# Altium schematic sheet JTAG.SchDoc: {Наименование}
size 420 x 297 mm; DocumentNumber: ПЛАС.ХХХХХХ.ХХХ ХХ; SheetNumber: 5; SheetTotal: 11; PageSetup: Record=PageOptions|CenterHorizontal=False|CenterVertical=False|PrintScale=0.95|XCorrection=0.00|YCorrection=0.00|PrintKind=1|BorderSize=5000000|LeftOffset=0|BottomOffset=0|Orientation=1|PaperLength=1000|PaperWidth=1000|Scale=100|PaperSource=15|PrintQuality=600|MediaType=1|DitherType=10|PaperKind=A4|PrintScaleMode=1; Rule: PcbType=ProtelPcb
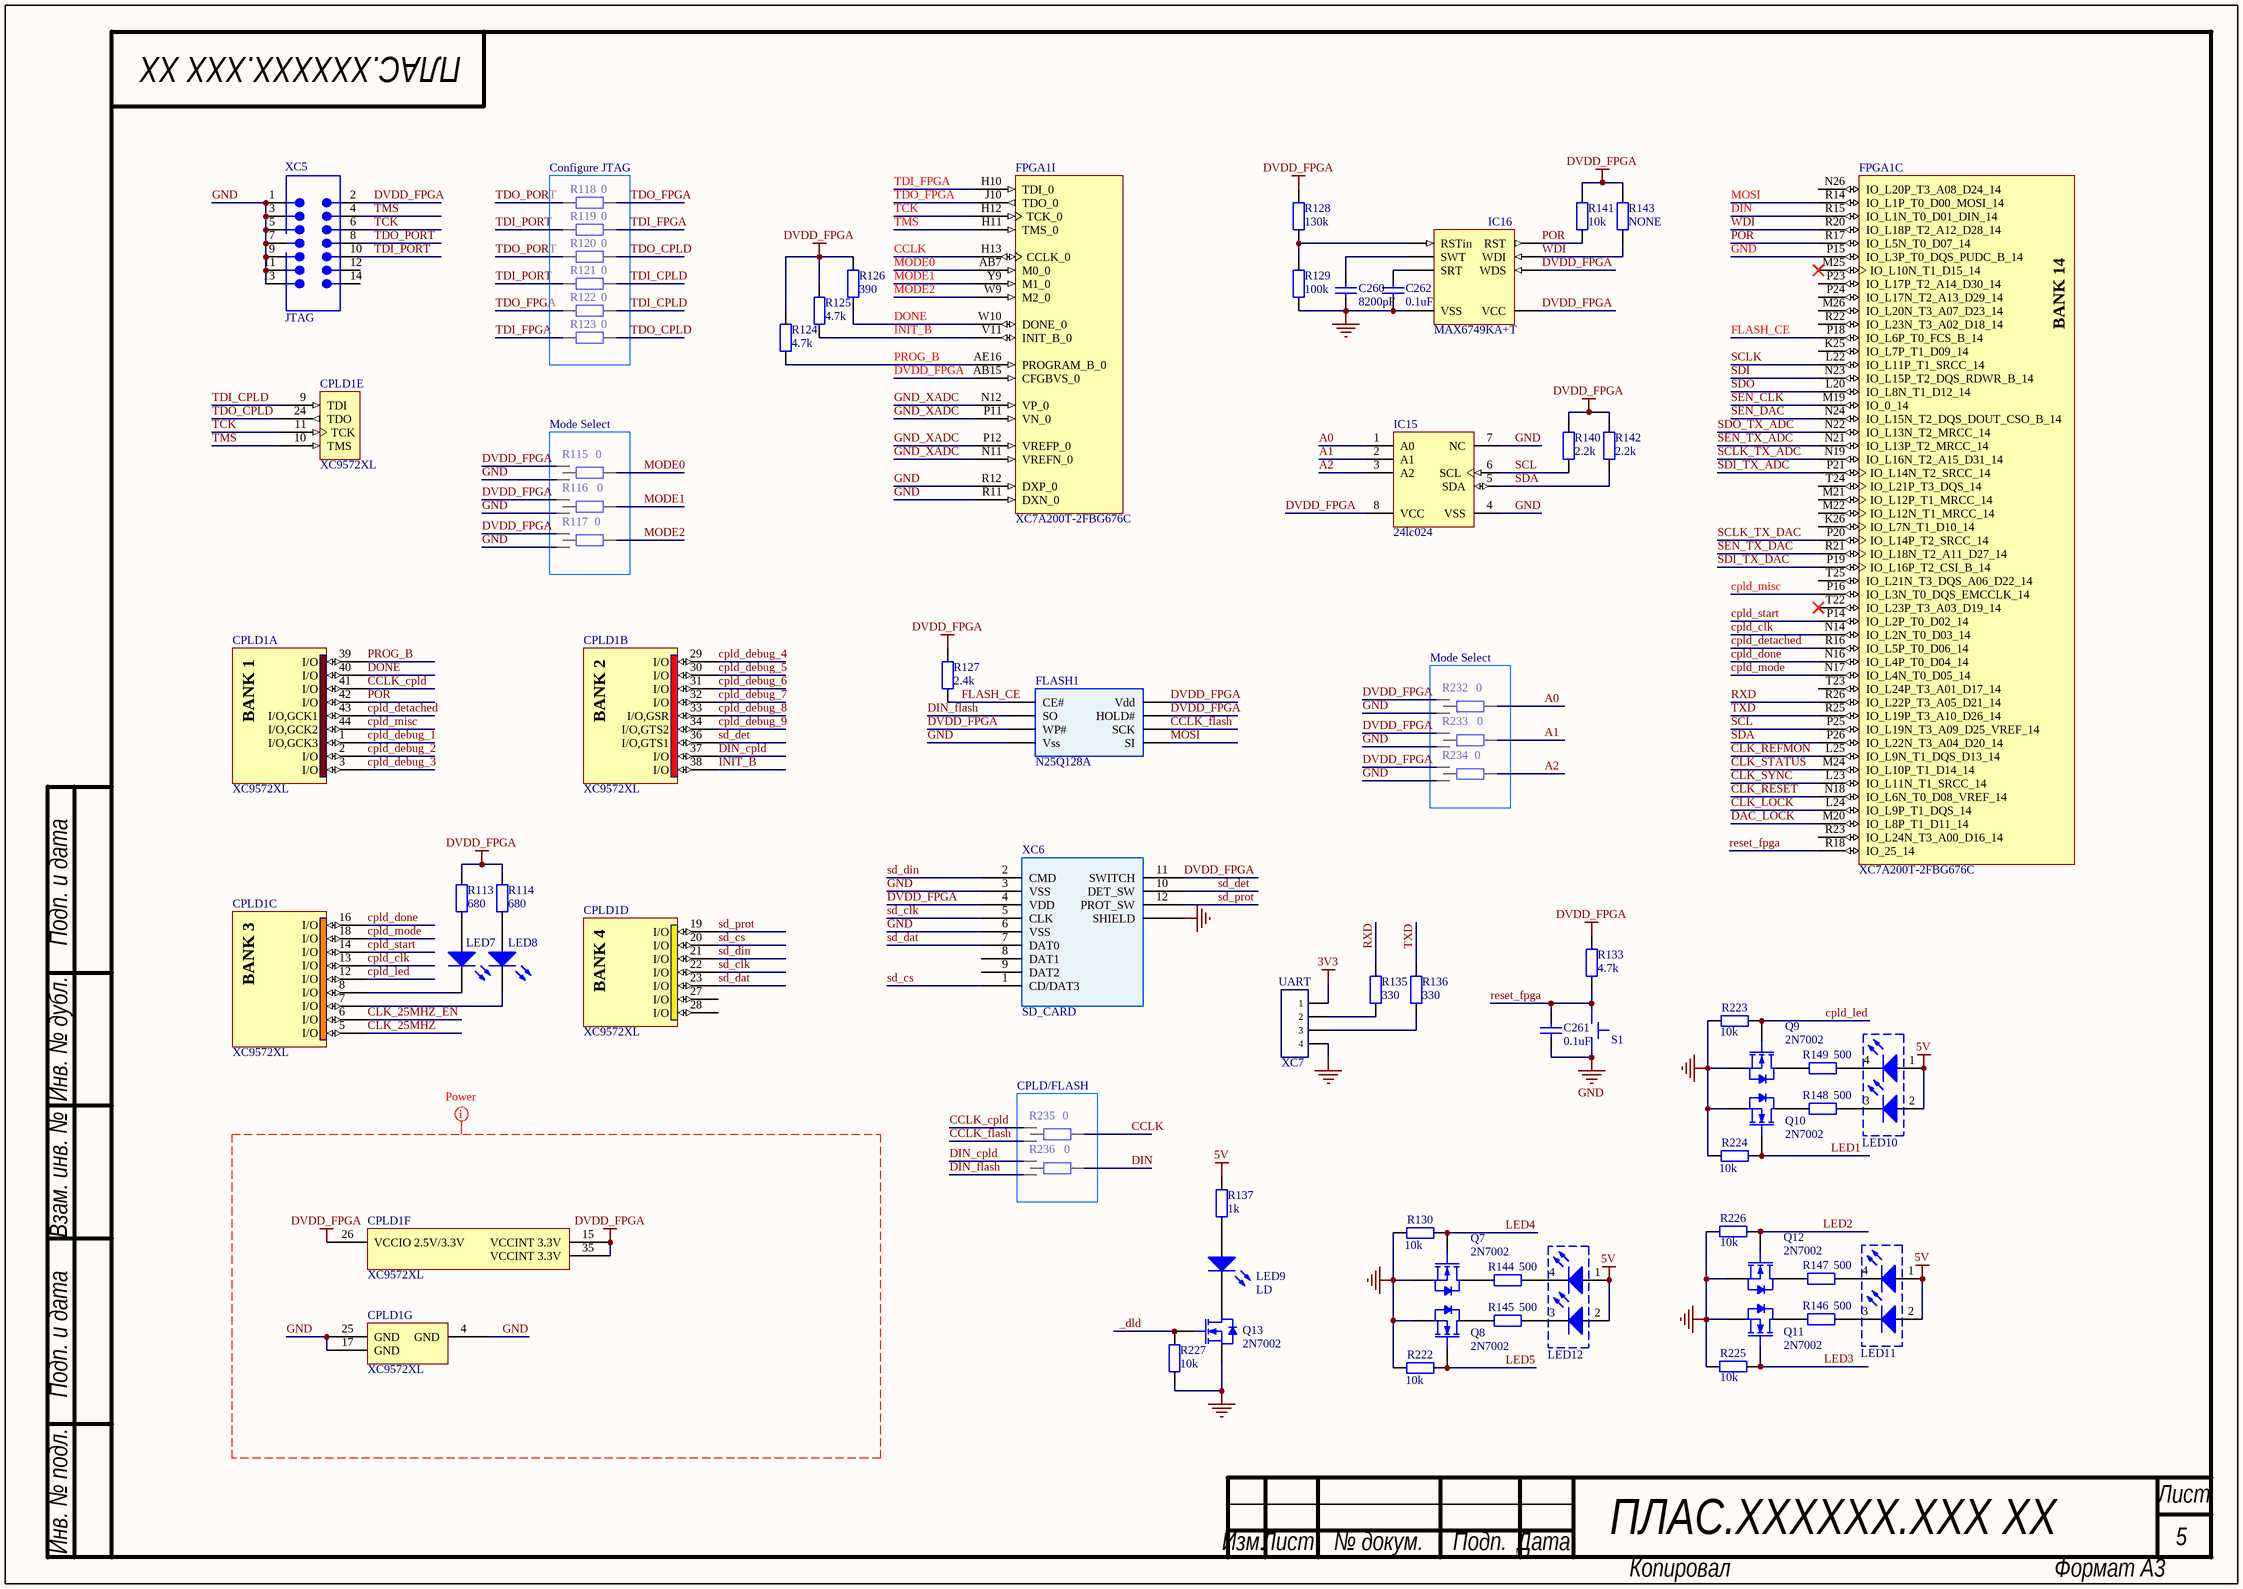
[diagram p0: JTAG.SchDoc]

## Parts
C260  value 8200pF  [C0603]  (hidden comment: Cap)
C261  value 0.1uF  [C0603]  (hidden comment: Cap)
C262  value 0.1uF  [C0603]  (hidden comment: Cap)
CPLD1  XC9572XL  [VQFP44]  (parts A,B,C,D,E,F,G of 7)
FLASH1  N25Q128A  [SOIC8-W]
FPGA1  XC7A200T-2FBG676C  [FGG676]  (parts C,I of 14)
IC15  24lc024  [SOIC_SN8]
IC16  MAX6749KA+T  [SOT-23-8]
LED7  LED  [LED_0402_Blue]  (value not drawn)
LED8  LED  [LED_0402_Blue]  (value not drawn)
LED9  LD  [LED_0402_Blue]
LED10  Green  [LED_PACK]  (value not drawn)
LED11  Green  [LED_PACK]  (value not drawn)
LED12  Green  [LED_PACK]  (value not drawn)
Q7  2N7002  [SOT-23]
Q8  2N7002  [SOT-23]
Q9  2N7002  [SOT-23]
Q10  2N7002  [SOT-23]
Q11  2N7002  [SOT-23]
Q12  2N7002  [SOT-23]
Q13  2N7002  [SOT-23]
R113  value 680  [R0402]  (hidden comment: Res)
R114  value 680  [R0402]  (hidden comment: Res)
R115  value 0  [R0402_Switch]  (hidden comment: Res_Switch)
R116  value 0  [R0402_Switch]  (hidden comment: Res_Switch)
R117  value 0  [R0402_Switch]  (hidden comment: Res_Switch)
R118  value 0  [R0402]  (hidden comment: Res)
R119  value 0  [R0402]  (hidden comment: Res)
R120  value 0  [R0402]  (hidden comment: Res)
R121  value 0  [R0402]  (hidden comment: Res)
R122  value 0  [R0402]  (hidden comment: Res)
R123  value 0  [R0402]  (hidden comment: Res)
R124  value 4.7k  [R0402]  (hidden comment: Res)
R125  value 4.7k  [R0402]  (hidden comment: Res)
R126  value 390  [R0402]  (hidden comment: Res)
R127  value 2.4k  [R0402]  (hidden comment: Res)
R128  value 130k  [R0402]  (hidden comment: Res)
R129  value 100k  [R0402]  (hidden comment: Res)
R130  value 10k  [R0402]  (hidden comment: Res)
R133  value 4.7k  [R0402]  (hidden comment: Res)
R135  value 330  [R0402]  (hidden comment: Res)
R136  value 330  [R0402]  (hidden comment: Res)
R137  value 1k  [R0402]  (hidden comment: Res)
R140  value 2.2k  [R0402]  (hidden comment: Res)
R141  value 10k  [R0402]  (hidden comment: Res)
R142  value 2.2k  [R0402]  (hidden comment: Res)
R143  value NONE  [R0402]  (hidden comment: Res)
R144  value 500  [R0402]  (hidden comment: Res)
R145  value 500  [R0402]  (hidden comment: Res)
R146  value 500  [R0402]  (hidden comment: Res)
R147  value 500  [R0402]  (hidden comment: Res)
R148  value 500  [R0402]  (hidden comment: Res)
R149  value 500  [R0402]  (hidden comment: Res)
R222  value 10k  [R0402]  (hidden comment: Res)
R223  value 10k  [R0402]  (hidden comment: Res)
R224  value 10k  [R0402]  (hidden comment: Res)
R225  value 10k  [R0402]  (hidden comment: Res)
R226  value 10k  [R0402]  (hidden comment: Res)
R227  value 10k  [R0402]  (hidden comment: Res)
R232  value 0  [R0402_Switch]  (hidden comment: Res_Switch)
R233  value 0  [R0402_Switch]  (hidden comment: Res_Switch)
R234  value 0  [R0402_Switch]  (hidden comment: Res_Switch)
R235  value 0  [R0402_Switch]  (hidden comment: Res_Switch)
R236  value 0  [R0402_Switch]  (hidden comment: Res_Switch)
S1  RST_FPGA  [B3FS-1000]  (value not drawn)
XC5  JTAG  [JTAG Mail]
XC6  SD_CARD  [SD_Card]
XC7  UART  [Right Angle Male Header]

## Blocks framed on the sheet
Configure JTAG: R118-R123
Mode Select: R115-R117
Mode Select: R232-R234
CPLD/FLASH: R235 R236

## Nets
3V3: XC7.1
5V: LED10.1(A) LED10.2(A) LED11.1(A) LED11.2(A) LED12.1(A) LED12.2(A) R137.2
DVDD_FPGA: CPLD1.15(VCCINT_3.3V) CPLD1.26(VCCIO_2.5V/3.3V) CPLD1.35(VCCINT_3.3V) FLASH1.3(WP#) FLASH1.7(HOLD#) FLASH1.8(Vdd) FPGA1.AB15(CFGBVS_0) IC15.8(VCC) IC16.5(WDS) IC16.8(VCC) R113.2 R114.2 R115.1 R116.1 R117.1 R124.1 R125.2 R126.1 R127.1 R128.2 R133.2 R140.2 R141.2 R142.2 R143.2 R232.1 R233.1 R234.1 XC5.2(VREF) XC6.4(VDD) XC6.11(SWITCH)
GND: C260.1 C261.2 C262.1 CPLD1.4(GND) CPLD1.17(GND) CPLD1.25(GND) FLASH1.4(Vss) FPGA1.P15(IO_L3P_T0_DQS_PUDC_B_14) FPGA1.R11(DXN_0) FPGA1.R12(DXP_0) IC15.4(VSS) IC15.7(NC) IC16.4(VSS) Q7.2(S) Q8.2(S) Q9.2(S) Q10.2(S) Q11.2(S) Q12.2(S) Q13.2(S) R115.3 R116.3 R117.3 R129.1 R130.2 R222.2 R223.2 R224.2 R225.2 R226.2 R227.1 R232.3 R233.3 R234.3 S1.2 XC5.1(GND) XC5.3(GND) XC5.5(GND) XC5.7(GND) XC5.9(GND) XC5.11(GND) XC5.13(GND) XC6.0(SHIELD) XC6.3(VSS) XC6.6(VSS) XC7.4
_dld: Q13.1(G) R227.2
A0: IC15.1(A0) R232.2
A1: IC15.2(A1) R233.2
A2: IC15.3(A2) R234.2
CCLK: FPGA1.H13(CCLK_0) R235.2
CCLK_cpld: CPLD1.41(I/O) R235.1
CCLK_flash: FLASH1.6(SCK) R235.3
CLK_25MHZ: CPLD1.5(I/O)
CLK_25MHZ_EN: CPLD1.6(I/O)
CLK_LOCK: FPGA1.L24(IO_L9P_T1_DQS_14)
CLK_REFMON: FPGA1.L25(IO_L9N_T1_DQS_D13_14)
CLK_RESET: FPGA1.N18(IO_L6N_T0_D08_VREF_14)
CLK_STATUS: FPGA1.M24(IO_L10P_T1_D14_14)
CLK_SYNC: FPGA1.L23(IO_L11N_T1_SRCC_14)
cpld_clk: CPLD1.13(I/O) FPGA1.N14(IO_L2N_T0_D03_14)
cpld_debug_1: CPLD1.1(I/O,GCK3)
cpld_debug_2: CPLD1.2(I/O)
cpld_debug_3: CPLD1.3(I/O)
cpld_debug_4: CPLD1.29(I/O)
cpld_debug_5: CPLD1.30(I/O)
cpld_debug_6: CPLD1.31(I/O)
cpld_debug_7: CPLD1.32(I/O)
cpld_debug_8: CPLD1.33(I/O,GSR)
cpld_debug_9: CPLD1.34(I/O,GTS2)
cpld_detached: CPLD1.43(I/O,GCK1) FPGA1.R16(IO_L5P_T0_D06_14)
cpld_done: CPLD1.16(I/O) FPGA1.N16(IO_L4P_T0_D04_14)
cpld_led: CPLD1.12(I/O) Q9.1(G) R223.1
cpld_misc: CPLD1.44(I/O,GCK2) FPGA1.P16(IO_L3N_T0_DQS_EMCCLK_14)
cpld_mode: CPLD1.18(I/O) FPGA1.N17(IO_L4N_T0_D05_14)
cpld_start: CPLD1.14(I/O) FPGA1.P14(IO_L2P_T0_D02_14)
DAC_LOCK: FPGA1.M20(IO_L8P_T1_D11_14)
DIN: FPGA1.R15(IO_L1N_T0_D01_DIN_14) R236.2
DIN_cpld: CPLD1.37(I/O) R236.1
DIN_flash: FLASH1.2(SO) R236.3
DONE: CPLD1.40(I/O) FPGA1.W10(DONE_0) R126.2
FLASH_CE: FLASH1.1(CE#) FPGA1.P18(IO_L6P_T0_FCS_B_14) R127.2
GND_XADC: FPGA1.N11(VREFN_0) FPGA1.N12(VP_0) FPGA1.P11(VN_0) FPGA1.P12(VREFP_0)
INIT_B: CPLD1.38(I/O) FPGA1.V11(INIT_B_0) R125.1
LED1: Q10.1(G) R224.1
LED2: Q12.1(G) R226.1
LED3: Q11.1(G) R225.1
LED4: Q7.1(G) R130.1
LED5: Q8.1(G) R222.1
MODE0: FPGA1.AB7(M0_0) R115.2
MODE1: FPGA1.Y9(M1_0) R116.2
MODE2: FPGA1.W9(M2_0) R117.2
MOSI: FLASH1.5(SI) FPGA1.R14(IO_L1P_T0_D00_MOSI_14)
POR: CPLD1.42(I/O) FPGA1.R17(IO_L5N_T0_D07_14) IC16.7(RST) R141.1
PROG_B: CPLD1.39(I/O) FPGA1.AE16(PROGRAM_B_0) R124.2
reset_fpga: C261.1 FPGA1.R18(IO_25_14) R133.1 S1.1
RXD: FPGA1.R26(IO_L22P_T3_A05_D21_14) R135.1
SCL: FPGA1.P25(IO_L19N_T3_A09_D25_VREF_14) IC15.6(SCL) R140.1
SCLK: FPGA1.L22(IO_L11P_T1_SRCC_14)
SCLK_TX_ADC: FPGA1.N19(IO_L16N_T2_A15_D31_14)
SCLK_TX_DAC: FPGA1.P20(IO_L14P_T2_SRCC_14)
sd_clk: CPLD1.22(I/O) XC6.5(CLK)
sd_cs: CPLD1.20(I/O) XC6.1(CD/DAT3)
sd_dat: CPLD1.23(I/O) XC6.7(DAT0)
sd_det: CPLD1.36(I/O,GTS1) XC6.10(DET_SW)
sd_din: CPLD1.21(I/O) XC6.2(CMD)
sd_prot: CPLD1.19(I/O) XC6.12(PROT_SW)
SDA: FPGA1.P26(IO_L22N_T3_A04_D20_14) IC15.5(SDA) R142.1
SDI: FPGA1.N23(IO_L15P_T2_DQS_RDWR_B_14)
SDI_TX_ADC: FPGA1.P21(IO_L14N_T2_SRCC_14)
SDI_TX_DAC: FPGA1.P19(IO_L16P_T2_CSI_B_14)
SDO: FPGA1.L20(IO_L8N_T1_D12_14)
SDO_TX_ADC: FPGA1.N22(IO_L13N_T2_MRCC_14)
SEN_CLK: FPGA1.M19(IO_0_14)
SEN_DAC: FPGA1.N24(IO_L15N_T2_DQS_DOUT_CSO_B_14)
SEN_TX_ADC: FPGA1.N21(IO_L13P_T2_MRCC_14)
SEN_TX_DAC: FPGA1.R21(IO_L18N_T2_A11_D27_14)
TCK: CPLD1.11(TCK) FPGA1.H12(TCK_0) XC5.6(TCK)
TDI_CPLD: CPLD1.9(TDI) R121.2 R122.2
TDI_FPGA: FPGA1.H10(TDI_0) R119.2 R123.1
TDI_PORT: R119.1 R121.1 XC5.10(TDI)
TDO_CPLD: CPLD1.24(TDO) R120.2 R123.2
TDO_FPGA: FPGA1.J10(TDO_0) R118.2 R122.1
TDO_PORT: R118.1 R120.1 XC5.8(TDO)
TMS: CPLD1.10(TMS) FPGA1.H11(TMS_0) XC5.4(TMS)
TXD: FPGA1.R25(IO_L19P_T3_A10_D26_14) R136.1
WDI: FPGA1.R20(IO_L18P_T2_A12_D28_14) IC16.6(WDI) R143.1
NetC260_2: C260.2 IC16.2(SWT)
NetC262_2: C262.2 IC16.3(SRT)
NetCPLD1_7: CPLD1.7(I/O) LED8.1(K)
NetCPLD1_8: CPLD1.8(I/O) LED7.1(K)
NetIC16_1: IC16.1(RSTin) R128.1 R129.2
NetLED7_2: LED7.2(A) R113.1
NetLED8_2: LED8.2(A) R114.1
NetLED9_1: LED9.1(K) Q13.3(D)
NetLED9_2: LED9.2(A) R137.1
NetLED10_3: LED10.3(K) R148.2
NetLED10_4: LED10.4(K) R149.1
NetLED11_3: LED11.3(K) R146.2
NetLED11_4: LED11.4(K) R147.2
NetLED12_3: LED12.3(K) R145.1
NetLED12_4: LED12.4(K) R144.1
NetQ7_3: Q7.3(D) R144.2
NetQ8_3: Q8.3(D) R145.2
NetQ9_3: Q9.3(D) R149.2
NetQ10_3: Q10.3(D) R148.1
NetQ11_3: Q11.3(D) R146.1
NetQ12_3: Q12.3(D) R147.1
NetR135_2: R135.2 XC7.2
NetR136_2: R136.2 XC7.3

Not connected (* = marked no-connect by the designer): CPLD1 27(I/O) 28(I/O); FPGA1 K25(IO_L7P_T1_D09_14) K26(IO_L7N_T1_D10_14) M21(IO_L12P_T1_MRCC_14) M22(IO_L12N_T1_MRCC_14) M25(IO_L10N_T1_D15_14)* M26(IO_L20N_T3_A07_D23_14) N26(IO_L20P_T3_A08_D24_14) P23(IO_L17P_T2_A14_D30_14) P24(IO_L17N_T2_A13_D29_14) R22(IO_L23N_T3_A02_D18_14) R23(IO_L24N_T3_A00_D16_14) T22(IO_L23P_T3_A03_D19_14)* T23(IO_L24P_T3_A01_D17_14) T24(IO_L21P_T3_DQS_14) T25(IO_L21N_T3_DQS_A06_D22_14); XC5 12(NC) 14(SRST); XC6 8(DAT1) 9(DAT2)

## Layout directives
net class Power: DVDD_FPGA, GND

## Notes on the sheet
- Подп. и дата
- Инв. № дубл.
- Взам. инв. №
- Инв. № подл.
- Лист
- Изм.
- № докум.
- Подп.
- Дата
- Копировал
- Формат А3
- (in symbol XC7A200T-2FBG676C, part C) BANK 14
- (in symbol XC9572XL-10VQ44C, part A) BANK 1
- (in symbol XC9572XL-10VQ44C, part B) BANK 2
- (in symbol XC9572XL-10VQ44C, part C) BANK 3
- (in symbol XC9572XL-10VQ44C, part D) BANK 4

## Library data of the parts
C260 = Cer Cap: Cer Cap Small; Manufacturer: Murata; Material: x7r; Voltage: 50V; Tolerance: 10%; Type: Ceramic; PackageReference: SMD Chip Capacitor; Package: 0603
C261 C262 = Cer Cap: Cer Cap Small; Manufacturer: Murata; Material: x7r; Voltage: 16V; Tolerance: 10%; Type: Ceramic; PackageReference: SMD Chip Capacitor; Package: 0603
CPLD1 = XC9572XL-10VQ44C: FastFLASH XC900XL, 3.3V High-Performance 72 Macrocell CPLD, 34 User I/Os, 44-Pin VQFP, Speed Grade 10, Commercial Grade; Supply Current: 20 mA; Max Operational Frequency: 100 MHz; Gates: 1600; Macrocells: 72; User I/O: 34; Name: XC9572XL-10VQ44C; Voltage: 3.3 V; Package: VQFP44; Type: CPLD
FLASH1 = SST25VF016B-xx-xx-S2Ax: SPI Flash; Manufacturer: Micron Technology; Name: N25Q128A13ESE40F; Operating Frequency: 50 MHz; Device Density: 128 Mbit; Voltage: 2.7-3.6V; Type: SPI Flash; Package: SOIC; Temperature Range: 0°C to +70°C
FPGA1 = XC7A200T-2FBG676C: Artix-7 FPGA, 400 User I/Os, 8 GTP, 676-Ball BGA, Speed Grade 2, Commercial Grade, Pb-Free; Manufacturer: Xilinx; Block RAM Blocks (18Kb): 730; Block RAM Blocks (36Kb): 365; Block RAM Blocks (Max Kb): 13140; CLBs (Slices): 33650; Clock Mgmt Tiles (CMTs): 10; DSP48E1 Slices: 740; Logic Cells: 215360; Max User I/O: 500; Speed Grade: -2; DatasheetVersion: v1.12; PackageVersion: Rev 1.8; PackageReference: FBG676; PackageDescription: Flip-Chip Lidless BGA, Body 27 x 27 mm, 1.0 mm Pitch; Supplier 1: Digi-Key; Supplier Part Number 1: 122-1865-ND; CLBs (Max Distributed RAM Kb): 2888; Generic Part Number: XC7A200T; RoHS: Pb-Free; NexusDeviceID: XC7A200T-2FBG676C; Mounting Technology: Surface Mount; Code_JEDEC: MS-034; PartNumber: XC7A200T-2FBG676C; ComponentLink1Description: Manufacturer URL; ComponentLink1URL: http://www.xilinx.com/; ComponentLink2Description: Datasheet; ComponentLink2URL: http://www.xilinx.com/support/documentation/data_sheets/ds180_7Series_Overview.pdf; ComponentLink3Description: Package Specification; ComponentLink3URL: http://www.xilinx.com/support/documentation/user_guides/ug475_7Series_Pkg_Pinout.pdf; ComponentLink4Description: DC and Switching Characteristics; ComponentLink4URL: http://www.xilinx.com/support/documentation/data_sheets/ds181_Artix_7_Data_Sheet.pdf; ComponentLink5Description: Package File; ComponentLink5URL: http://www.xilinx.com/support/packagefiles/a7packages/xc7a200tfbg676pkg.txt; ComponentLink6Description: Packaging and Pinout; ComponentLink6URL: http://www.xilinx.com/support/documentation/user_guides/ug475_7Series_Pkg_Pinout.pdf
IC15 = 24lc024: I2C EEPROM; Manufacturer: Microchip; Voltage: 2.5-5.5V; Max Clock: 400 kHz; Capacity: 2 Kbit; Name: 24lc024; Type: I2C EEPROM; Package: SOIC-8
IC16 = MAX6749KA+T: uC Reset Circuits; Manufacturer: Maxim; Voltage: 1.0-5.5V; RESET IN Threshold: 1.235V; Name: MAX6749KA+T; Package: 8 SOT23
LED7-LED9 = LED: Typical RED, GREEN, YELLOW, AMBER GaAs LED; Manufacturer: Kingbright; Color: Blue; P/N: APHHS1005QBC/D; Package: 0402; Name: LED
LED10-LED12 = LED_PACK: LED Pack For Front Panel; Manufacturer: Kingbright; Type: 2-level PCB-mount LED-indicator; Current: 25mA; P/N: WP934EB/2GD; Color: Green; Package: Throu-Hole
Q7-Q13 = 2N7002: N-Channel MOSFET 2N7002; Current: 300mA; Voltage: 60V; Channel Resistance: 5Ohm; Power Dissipation: 0.83W; Name: 2N7002; Type: N-Channel MOSFET; Package: SOT-23
R113 R114 R118-R130 R133 R135-R137 R140-R149 R222-R227 = Res: Resistor; Name: Chip SMD Resistor; Tolerance: 5%; Power: 0.062 Wt; Temperature Range: -55…155
  R113 R114 R118-R129 R133 R135 R136 R140-R149: Package: SMD
  R130 R137 R222-R227: Package: 0402
R115-R117 R232-R236 = Res_Switch: Resistor; Name: Chip SMD Resistor; Tolerance: 5%; Power: 0.062 Wt; Package: SMD; Temperature Range: -55…155
S1 = Push Button: Manufacturer: Omron; Operating  force: 2.55 N; Plunger  color: Black; Voltage: 24V; Current: 50mA; Name: B3FS-1000; Type: Tactile Switch (SMT); Package: 6x6 SMT; Series: B3FS-1000
XC5 = JTAG Male: Male Header JTAG; Manufacturer: CNC Tech; Name: BOX HEADER, 0.050 14 POS; P/N: 3220-14-0100-00; Type: Two Row Male Header .050'' Step
XC6 = SD_Card: Manufacturer: Tyco Electronics; Name: 1775059-1; Type: SD Card Connector, Reverse Type; Package: SMD PCB Mount
XC7 = 4-Way Header: 4-Way Angle PCB Header; Pitch: 2.54mm; Name: Header; Type: Right Angle; Package: Through Hole